# EAGLE design smartdim (EAGLE 7.5.0)
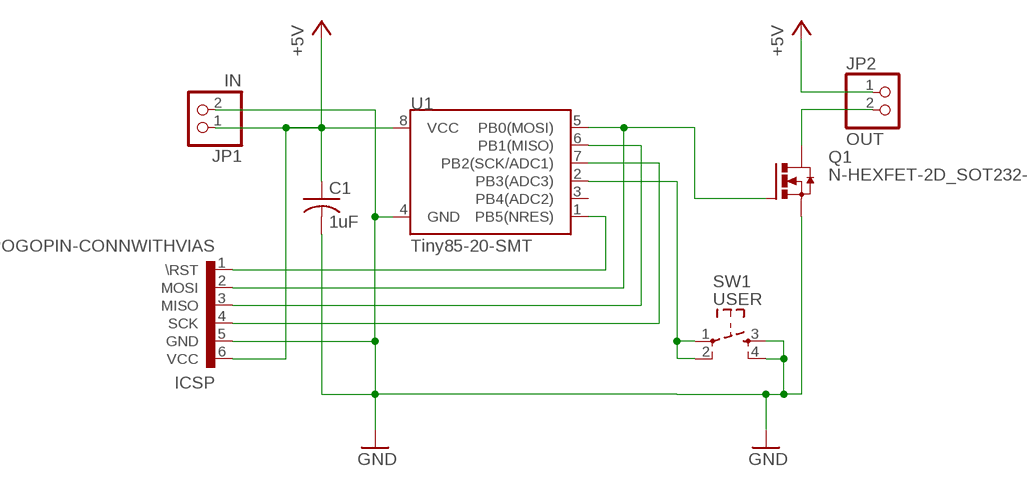
[diagram p0: schematic, sheet 1]

## Parts
C1  1uF  C-USC0805  [C0805]
ICSP  POGOPIN-CONNWITHVIAS  [POGOPROG-CONN-0H]
JP1  IN  PINHD-1X2  [1X02]
JP2  OUT  PINHD-1X2  [1X02]
Q1  N-HEXFET-2D_SOT232-  [SOT223]
SW1  USER  SW_TACT_4P  [SW_TACT_SMALL]
U1  Tiny85-20-SMT  ATTINY45TINY85-20-SMT  [SO08-EIAJ]

## Nets
+5V: C1.1 ICSP.6(VCC) JP1.1 JP2.1 U1.8(VCC)
GND: C1.2 ICSP.5(GND) JP1.2 Q1.3(S) SW1.3 SW1.4 U1.4(GND)
MISO: ICSP.3(MISO) U1.6(PB1(MISO))
MOSI/PWM: ICSP.2(MOSI) Q1.1(G) U1.5(PB0(MOSI))
NRES: ICSP.1(\RST) U1.1(PB5(NRES))
PWM_VSS: JP2.2 Q1.2(D) Q1.4(D)
SCK: ICSP.4(SCK) U1.7(PB2(SCK/ADC1))
USER_INPUT: SW1.1 SW1.2 U1.2(PB3(ADC3))
Unconnected: U1.3(PB4(ADC2))

## Library data of the parts
C1 = rcl:C-US: CAPACITOR, American symbol
ICSP = Protofusion:POGOPIN-CONN: Protofusion custom pogo pin programming header
JP1 JP2 = pinhead:PINHD-1X2: PIN HEADER
Q1 = transistor-power:N-HEXFET-2D_?-*: HEXFET® Power MOSFET 2 Drain connects http://www.irf.com/product-info/datasheets/data/irll014n.pdf
SW1 = dp_devices:SW_TACT_4P
U1 = SparkFun-DigitalIC:ATTINY45: Atmel 8-pin 2/4/8kB flash uC; PROD_ID: IC-09092

## Board
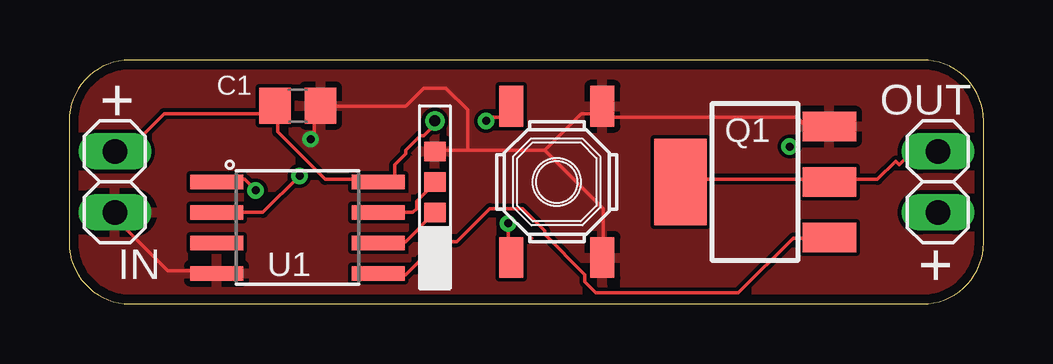
[diagram p1: board, top side]
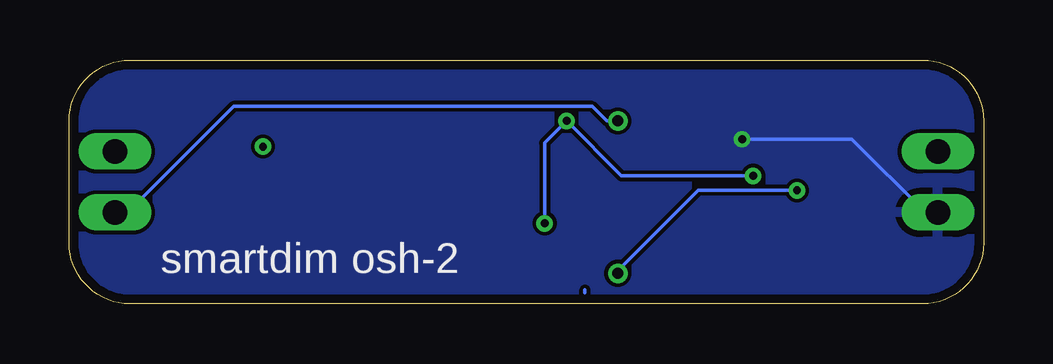
[diagram p2: board, bottom side, seen from below]

Size 38.1 x 10.16 mm. Coordinates in mm from the lower left corner, seen from the top.
Outline: 0,7.62 0,2.54 arc90 2.54,0 35.56,0 arc90 38.1,2.54 38.1,7.62 arc90 35.56,10.16 2.54,10.16 arc90 0,7.62
Copper layers (1*16): Top 0.0356mm / dielectric 1.5011mm / Bottom 0.0356mm
Design rules "LaenPCBOrder": minimum track width 6mil, minimum drill 13mil, track to track 6mil, track to pad 6mil, pad to pad 6mil, via to via 6mil, smd to smd 6mil, copper to edge 15mil, drill to drill 6mil, minimum pad ring 7mil, minimum via ring 7mil, stop-mask expansion 3mil, vias tented up to drill 0mil, thermal gap 10mil
vRestrict: area 19.1,1.3 to 34.3,2.5

### Footprints (pad centres in the part's own frame; a part is rotated, then mirrored left to right if it is on the bottom)
C0805 = smd 1.3 x 1.5: 1 -0.95,0; 2 0.95,0
POGOPROG-CONN-0H = drill 0.457: 1 0,3.81; 6 0,-2.54 | smd 0.889 x 0.813: 2 0,2.54; 3 0,1.27; 4 0,0; 5 0,-1.27
1X02 = drill 1.016 long: 1 -1.27,0; 2 1.27,0
SOT223 = smd 1.219 x 2.235: 1 -2.311,-3.099; 2 0,-3.099; 3 2.311,-3.099 | smd 3.6 x 2.2: 4 0,3.099
SW_TACT_SMALL = smd 1.7 x 1: 1 -3.15,1.9; 2 3.15,1.9; 3 -3.15,-1.9; 4 3.15,-1.9
SO08-EIAJ = smd 0.61 x 2.21: 1 -1.905,-3.378; 2 -0.635,-3.378; 3 0.635,-3.378; 4 1.905,-3.378; 5 1.905,3.353; 6 0.635,3.353; 7 -0.635,3.353; 8 -1.905,3.353

### Placement (x,y rotation side)
C1  9.53,8.26 0 top
ICSP  15.24,5.08 180 top
JP1  1.91,5.08 270 top
JP2  36.2,5.08 90 top
Q1  28.57,5.08 90 top
SW1  20.32,5.08 90 top
U1  9.53,3.17 270 top

### Tracks (layer width: path | path; a pad name or v marks a point on that pad's centre or on a via)
+5V
  Top 0.152: 8.69,7.92 8.69,7.16 10.67,5.18 12.8,5.18 U1.8 12.95,5.18 13.41,5.18 13.56,5.33 13.56,5.79 14.02,6.25 14.02,6.4 14.63,7.01 14.78,7.01 15.24,7.47 ICSP.6 | 8.69,7.92 8.69,8.23 C1.1 8.69,7.92 | 8.69,7.92 3.96,7.92 2.44,6.4 1.98,6.4 JP1.1
  Bottom 0.152: ICSP.6 15.7,7.62 16.31,8.23 31.24,8.23 35.66,3.81 36.12,3.81 JP2.1
GND  (via drill 0.33)
  Top 0.152: U1.4 6.1,1.37 4.12,1.37 1.98,3.5 1.98,3.81 JP1.2 | 19.81,6.4 16.61,6.4 | 16.61,6.4 15.24,6.4 ICSP.5 | 19.81,6.4 21.34,7.92 21.79,7.92 22.1,8.23 SW1.4 22.25,8.23 22.71,7.77 30.33,7.77 30.63,7.47 31.55,7.47 Q1.3 | 16.61,6.4 16.61,8.08 15.7,8.99 14.78,8.99 14.02,8.23 10.52,8.23 C1.2 10.36,8.23 10.21,8.08 10.21,7.01 v10.06,6.86 | 19.81,6.4 22.25,3.96 22.25,1.98 SW1.3
  Bottom 0.152: v10.06,6.86 5.49,6.86 2.44,3.81 1.98,3.81 JP1.2
  pour Bottom: 0,11.43 39.37,11.43 39.37,-1.27 -1.27,-1.27 -1.27,11.43
  pour Top: -2.54,12.7 40.64,12.7 40.64,-2.54 -2.54,-2.54
GNDXX  (via drill 0.33)
  other vias: 30.02,6.55
MISO
  Top 0.152: ICSP.3 14.02,2.59 12.95,2.59 U1.6
MOSI/PWM
  Top 0.152: U1.5 12.95,1.22 14.02,1.22 15.24,2.44 ICSP.2 15.24,2.59 16.15,2.59 17.53,3.96 18.9,3.96 19.81,3.05 19.81,2.9 21.49,1.22 21.49,0.91 21.95,0.46 27.89,0.46 30.18,2.74 31.55,2.74 Q1.1
N$1
  Bottom 0.152: 16.61,0.46 16.61,0.58 16.61,0.46
N$2
  Top 0.152: 19.2,2.74 19.28,2.74 19.2,2.74
NRES  (via drill 0.33)
  Top 0.152: v7.77,4.72 7.32,5.18 6.25,5.18 U1.1
  Bottom 0.152: v7.77,4.72 11.89,4.72 15.24,1.37 ICSP.1
PWM_VSS
  Top 0.152: JP2.2 36.12,6.25 35.05,6.25 34.59,5.79 34.44,5.94 33.68,5.18 31.7,5.18 Q1.2 31.55,5.18 25.6,5.18 Q1.4
SCK
  Top 0.152: ICSP.4 15.24,5.03 14.48,4.27 14.48,3.96 14.33,3.81 12.95,3.81 U1.7
USER_INPUT  (via drill 0.33)
  Top 0.152: v18.29,3.35 18.29,1.98 SW1.1 | v17.37,7.62 17.53,7.77 17.98,7.77 18.44,8.23 SW1.2 | v9.6,5.33 8.08,3.81 6.25,3.81 U1.2
  Bottom 0.152: v18.29,3.35 18.29,6.71 v17.37,7.62 15.09,5.33 v9.6,5.33

### Text on the board
tPlace: + | +
bPlace: smartdim osh-2